# Altium schematic sheet Power.SchDoc
size A; SheetNumber: 2; SheetTotal: 3
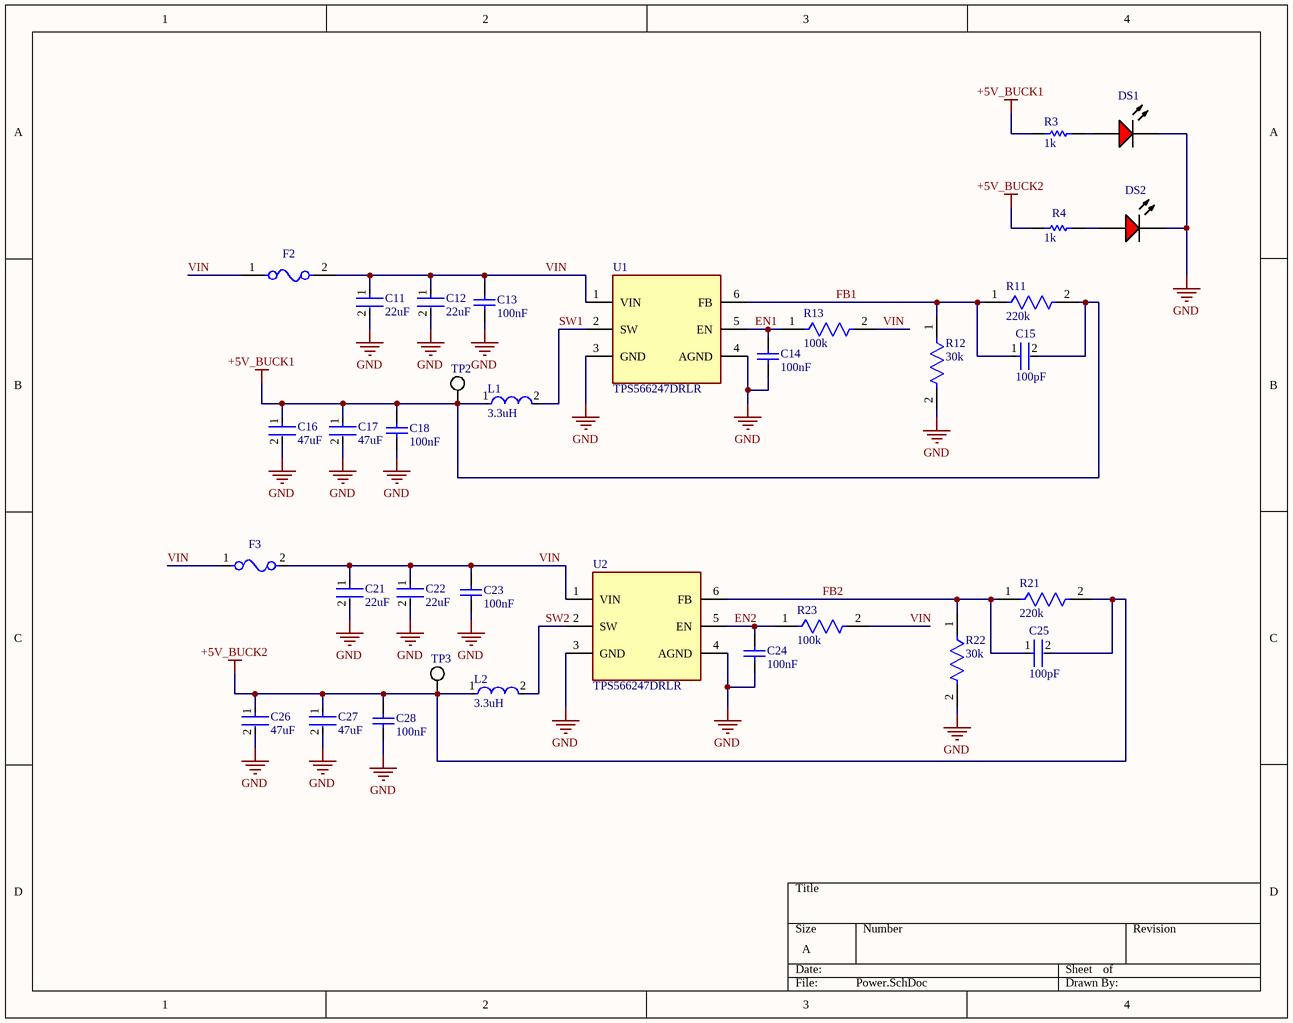
[diagram p0: Power.SchDoc]

## Parts
C11  22uF  [FP-1206-L_3_2_0_3-W_1_6_0-IPC_A]
C12  22uF  [FP-1206-L_3_2_0_3-W_1_6_0-IPC_A]
C13  100nF  [CAPC1206(3216)170_L]
C14  100nF  [CAPC1206(3216)170_L]
C15  100pF  [FP-C0805C-DN-MFG]
C16  47uF  [FP-1210-L_3_2_0_3-W_2_5_0-IPC_B]
C17  47uF  [FP-1210-L_3_2_0_3-W_2_5_0-IPC_B]
C18  100nF  [CAPC1206(3216)170_L]
C21  22uF  [FP-1206-L_3_2_0_3-W_1_6_0-IPC_A]
C22  22uF  [FP-1206-L_3_2_0_3-W_1_6_0-IPC_A]
C23  100nF  [CAPC1206(3216)170_L]
C24  100nF  [CAPC1206(3216)170_L]
C25  100pF  [FP-C0805C-DN-MFG]
C26  47uF  [FP-1210-L_3_2_0_3-W_2_5_0-IPC_B]
C27  47uF  [FP-1210-L_3_2_0_3-W_2_5_0-IPC_B]
C28  100nF  [CAPC1206(3216)170_L]
DS1  SML-LX1206IC-TR  [LUMX-SML-LX1206IC_V]  (value not drawn)
DS2  SML-LX1206IC-TR  [LUMX-SML-LX1206IC_V]  (value not drawn)
F2  0466003.NR  [FP-0466-MFG]  (value not drawn)
F3  ERB-RE2R00V  [FP-ERBRE-MFG]  (value not drawn)
L1  3.3uH  [FP-IHLP-4040DZ-FP_3_124x3-MFG]
L2  3.3uH  [FP-IHLP-4040DZ-FP_3_124x3-MFG]
R3  1k  [RESC3216X60X45ML10T20]
R4  1k  [RESC3216X60X45ML10T20]
R11  220k  [FP-CRGCQ1206-IPC_C]
R12  30k  [FP-MCU0805-MFG]
R13  100k  [FP-RP732B-MFG]
R21  220k  [FP-CRGCQ1206-IPC_C]
R22  30k  [FP-MCU0805-MFG]
R23  100k  [FP-RP732B-MFG]
TP2  Test Point  [Test Point]  (value not drawn)
TP3  Test Point  [Test Point]  (value not drawn)
U1  TPS566247DRLR  [SOTFL50P160X60-6N]
U2  TPS566247DRLR  [SOTFL50P160X60-6N]

## Nets
+5V_BUCK1: C15.2 C16.1 C17.1 C18.2 L1.1 R3.1 R11.2 TP2.1
+5V_BUCK2: C25.2 C26.1 C27.1 C28.2 L2.1 R4.1 R21.2 TP3.1
GND: C11.2 C12.2 C13.1 C14.1 C16.2 C17.2 C18.1 C21.2 C22.2 C23.1 C24.1 C26.2 C27.2 C28.1 DS1.2(K) DS2.2(K) R12.2 R22.2 U1.3(GND) U1.4(AGND) U2.3(GND) U2.4(AGND)
EN1: C14.2 R13.1 U1.5(EN)
EN2: C24.2 R23.1 U2.5(EN)
FB1: C15.1 R11.1 R12.1 U1.6(FB)
FB2: C25.1 R21.1 R22.1 U2.6(FB)
SW1: L1.2 U1.2(SW)
SW2: L2.2 U2.2(SW)
VIN: C11.1 C12.1 C13.2 C21.1 C22.1 C23.2 F2.1 F2.2 F3.1 F3.2 R13.2 R23.2 U1.1(VIN) U2.1(VIN)
NetDS1_1: DS1.1(A) R3.2
NetDS2_1: DS2.1(A) R4.2

## Library data of the parts
C11 C12 C21 C22 = CMP-14477-000099-2: None; Tolerance: 20%; Voltage Rating: 16V; Dielectric: X7R; Lead Free: Lead Free; Min Operating Temperature: -55°C; Max Operating Temperature: 125°C; Case/Package: 1206; RoHS Compliant: Yes; Case Code (Metric): 3216; Width: 0.063inch; Case Code (Imperial): 1206; Thickness: 0.071inch; Capacitance: 22uF; Packaging: Tape and Reel; Length: 0.126inch; Mount: Surface Mount
C13 C14 C18 C23 C24 C28 = CMP-1037-04201-1: CAP 100nF 50V ±10% 1206 (3216 Metric) Thickness 1.7mm SMD; Case-Metric: 3216; Tolerance: Â±10%; Case-EIA: 1206; Value: 100nF; Max Thickness: 1.7 mm; Rated Voltage: 50 V; Technology: SMT
C15 C25 = CMP-2007-00229-2: CAP CER 100PF 50V 10% X7R 0805 (used for feed-forward); Manufacturer: KEMET; Manufacturer Part Number: C0805C101K5RACTU; Material: Ceramic; Temperature Coefficient: 30ppm/°C; Tolerance: 0.1; Device Class L3: Ceramic Capacitors; Octopart: https://octopart.com/c0805c101k5ractu-kemet-10441514; Lead Free: Yes; Category: Cap; Automotive: No; Value: 100 pF; RoHS: TRUE; Height: 0.88mm; ComponentLink2Description: Datasheet; ComponentLink2URL: https://content.kemet.com/datasheets/KEM_C1003_C0G_SMD.pdf; Digikey Description: CAP CER 100PF 50V 10% X7R 0805; Package: C0805C-DN; Temperature: -55°C to +125°C; Device Class L1: Passive Components; Temperature Characteristic: X7R; Voltage Rating: 50 V; Temperature Range Low: -55°C; Capacitance: 100 pF; Temperature Range High: +125°C; Mouser Description: Cap Ceramic 100pF 50V X7R 10% Pad SMD 0805 125°C T/R; Ipc Land Pattern Name: CAPC200125X78; Device Class L2: Capacitors
C16 C17 C26 C27 = CMP-14477-000081-1: Capacitor Ceramic Multilayer 47uF 10% 10V X7R SMD 1210; Packaging: Tape and Reel; Width: 0.098inch; Case/Package: 1210; Mount: Surface Mount; Thickness: 0.106inch; RoHS Compliant: Yes; Voltage Rating: 10V; Capacitance: 47uF; Tolerance: 10%; Max Operating Temperature: 125°C; Length: 0.126inch; Min Operating Temperature: -55°C
DS1 DS2 = CMP-2000-07123-1: LED Red, 65 mW, -40 to 85 degC, 2-Pin SMD, RoHS, Tape and Reel; Manufacturer: Lumex; LED Material: GaAsP; Peak Wavelength: 635nm; Number of LEDs: 1; Viewing Angle: 160; Reverse Voltage: 5(Min)V; Lens Appearance: ColorlessNonDiffused; Intensity: 6mcd; Type: Uni-Color; Pin_Count: 2; Lens Dimensions: 2x1.6x0.5mm; Mounting: SurfaceMount; ECCN: EAR99; RoHS: Unknown; Package Description: 2-Pin Surface Mount Device, Body 3.2 x 1.5 mm; Mounting Technology: SurfaceMount; Dominant Wavelength: N/A; Supplier_Package: SMD; Supplier Standard Pack: 3,000; Color: Red; Dimension: 3.2x1.6x1.1mm; HTS: 8541402000; Part No: SML-LX1206IC-TR; Family: SML-LX1206IC; Supplier: Lumex; Datasheet URL: http://www.lumex.com/content/files/ProductAttachment/SML-LX1206IC-TR.pdf; Package Reference: SML-LX1206IC; Manufacturer URL: http://www.lumexinstruments.com/; Operating Temperature: -25to85C; Packaging: TapeandReel; Datasheet Version: Rev. J, 08/2012
F2 = CMP-08605-000054-1: FUSE BOARD MNT 3A 32VAC/VDC 1206; Manufacturer: Littelfuse; Fuse Interrupt Ac Current: 50A; Fuse Voltage Drop: 75.99mV; Max Fuse Ac Voltage: 32V; Fuse I2T: 0.576A2Sec; Resistance: 0.019Ω; Fuse Blow Speed: Fast; Value: 0.019Ω; ComponentLink2Description: Datasheet; Fuse Current: 3A; RoHS: TRUE; Mouser Description: Surface Mount Fuses 32V 3A VFA Slimline; Height: 0.66mm; Octopart: https://octopart.com/0466003.nr-littelfuse-565175; Package: 0466; Fuse Interrupt Dc Current: 50A; Manufacturer Part Number: 0466003.NR; Temperature Range Low: -55°C; ComponentLink2URL: https://www.littelfuse.com/~/media/electronics/datasheets/fuses/littelfuse_fuse_466_datasheet.pdf.pdf; Digikey Description: FUSE BOARD MNT 3A 32VAC/VDC 1206; Voltage Rating: 32V; Category: Fuse; Lead Free: Yes; Device Class L2: Fuses; Automotive: No; Max Fuse Dc Voltage: 32V; Temperature Range High: +90°C; Device Class L3: unset; Device Class L1: Circuit Protection; Temperature: -55°C to +90°C
F3 = CMP-00287-21220540-1: ERB-RE2R00V Fuse Chip Fast Acting 2A 32V SMD Solder Pad 0603 1.6 X 0.8 X 0.54mm T/R UL/cUL; Approvals: UL; Resistance: 51mΩ; Body Material: Alumina; Case/Package: 0603; Packaging: Cut Tape; RoHS: Compliant; Width: 800µm; Min Operating Temperature: -40°C; Length: 1.6mm; Mount: Surface Mount; Radiation Hardening: No; Voltage Rating: 32V; Voltage Rating (DC): 32V; REACH SVHC: No SVHC; Case Code (Imperial): 0603; Height: 640µm; Lifecycle Status: Production; Depth: 800µm; Current: 2A; Fuse Current: 2A; Max Operating Temperature: 125°C; Current Rating: 2A; Number of Pins: 2; Lead Free: Lead Free; Case Code (Metric): 1608; Max Voltage Rating (DC): 32V
L1 L2 = CMP-02424-000263-1: Commercial Inductors, High Saturation Series 3.3uH 10A 14.4mΩ 20%; Test Frequency: 100kHz; DC Resistance (DCR): 14.4mR; Shielding: Shielded; Max DC Current: 18.6A; Core Material: Metal; Self Resonant Frequency: 5MHz; Width: 0.405inch; RMS Current (Irms): 10A; Weight: 0.070548oz; Number of Pins: 4040; Height: 4mm; Tolerance: 20%; Contact Plating: Tin; Termination: SMD/SMT; Case Code (Imperial): 4040; Length: 0.43inch; Lead Free: Lead Free; Military Standard: Not; Depth: 10.3mm; Mount: Surface Mount; Radiation Hardening: No; Current Rating: 10A; Min Operating Temperature: -55°C; Height - Seated (Max): 0.157inch; Max Operating Temperature: 125°C; Inductance Tolerance: 20%; Packaging: Tape and Reel; Case/Package: 4040; Package Quantity: 500; Inductance: 3.3uH; Saturation Current: 18.6A
R3 R4 = CMP-2003-01869-1: Manufacturer: Vishay Dale; Part Number: CRCW12061K00JNTA
R11 R21 = CMP-03211-009600-1: CRGCQ1206 220KΩ 0.25W 1% ±100ppm/°C 200V; Manufacturer: TE Connectivity; Manufacturer Part Number: CRGCQ1206F220K; Tolerance: 0.01; ComponentLink2URL: https://www.te.com/commerce/DocumentDelivery/DDEController?Action=showdoc&DocId=Data+Sheet%7F1773204-3%7F1%7Fpdf%7FEnglish%7FENG_DS_1773204-3_1.pdf%7F4-2176347-1222; Composition: Thick Film; Voltage Rating: 200V; Automotive Grade: Grade 1213; Temperature Range High: +155°C; Package: CRGCQ1206; Octopart: https://octopart.com/crgcq1206f220k-te+connectivity-91018263; Device Class L3: Chip SMD Resistors; Height: 0.65mm; Device Class L2: Resistors; Series: CRGCQ; Category: Res; Temperature Coefficient: ±100ppm/°C; Value: 220KΩ; Ambient Temperature Range High: +70°C; Lead Free: Yes; Power Rating: 0.25W; Resistance: 220KΩ; Device Class L1: Passive Components; Ipc Land Pattern Name: RESC310155X55; Temperature Range Low: -55°C; Temperature: -55°C to +155°C; Automotive: Yes; RoHS: TRUE; ComponentLink2Description: Datasheet
R12 R22 = CMP-02407-001702-1: Thin Film Resistors - SMD MCU 0805-50 1% P5 30K; Temperature Coefficient: 50ppm/°C; Resistance: 30kR; Case/Package: 0805; Composition: Thin Film; Height: 450um; Tolerance: 1%; Width: 1.25mm; Max Operating Temperature: 125°C; Lead Free: Lead Free; Radiation Hardening: No; Min Operating Temperature: -55°C; Contact Plating: Tin; Length: 2mm
R13 R23 = CMP-03211-007900-1: Res Thin Film 1206 100KΩ 0.1% 0.25W 15ppm/°C Molded SMD; Manufacturer: TE Connectivity; Manufacturer Part Number: RP73D2B100KBTG; Voltage Rating: 200V; ComponentLink2URL: https://www.te.com/commerce/DocumentDelivery/DDEController?Action=showdoc&DocId=Data+Sheet%7F1773272%7FL%7Fpdf%7FEnglish%7FENG_DS_1773272_L.pdf%7F8-1879255-6; Category: Res; Temperature Coefficient: 15ppm/°C; Temperature Range High: 155°C; Height: 0.65mm; Ipc Land Pattern Name: RESC305155X55; Power Rating: 0.25W; Tolerance: 0.1%; ComponentLink2Description: Datasheet; Value: 100KΩ; Series: RP73; Octopart: https://octopart.com/rp73d2b100kbtg-te+connectivity-42012337; Automotive: No; packaging: 250 cut tape length; Temperature: -55°C to 155°C; octopart_url: https://octopart.com/rp73d2b100kbtg-te+connectivity-42012337; Lead Free: Yes; Device Class L2: Resistors; RoHS: TRUE; Composition: Thin Film; Device Class L3: Chip SMD Resistors; Package: RP732B; Device Class L1: Passive Components; Temperature Range Low: -55°C; Resistance: 100KΩ
TP2 TP3 = CMP-00030-00006-7
U1 U2 = CMP-012-000006-2: Switching Voltage Regulators 3-V to 16-V input voltage, 6-A FCCM mode, synchronous buck converter in SOT-563 package; Manufacturer_Name: Texas Instruments; Geometry.Height: 0.6mm; Mouser Price/Stock: https://www.mouser.co.uk/ProductDetail/Texas-Instruments/TPS566247DRLR?qs=t7xnP681wgXvPlQds8kDLA%3D%3D; Source: TPS566247DRLR.SchLib; Manufacturer_Part_Number: TPS566247DRLR; Mouser Part Number: 595-TPS566247DRLR; Design Item ID: TPS566247DRLR; Datasheet Link: https://www.ti.com/lit/ds/symlink/tps566247.pdf?ts=1660699623182&ref_url=https%253A%252F%252Fwww.ti.com%252Fproduct%252FTPS566247